# EAGLE design esc_board1 (EAGLE 9.2.2)
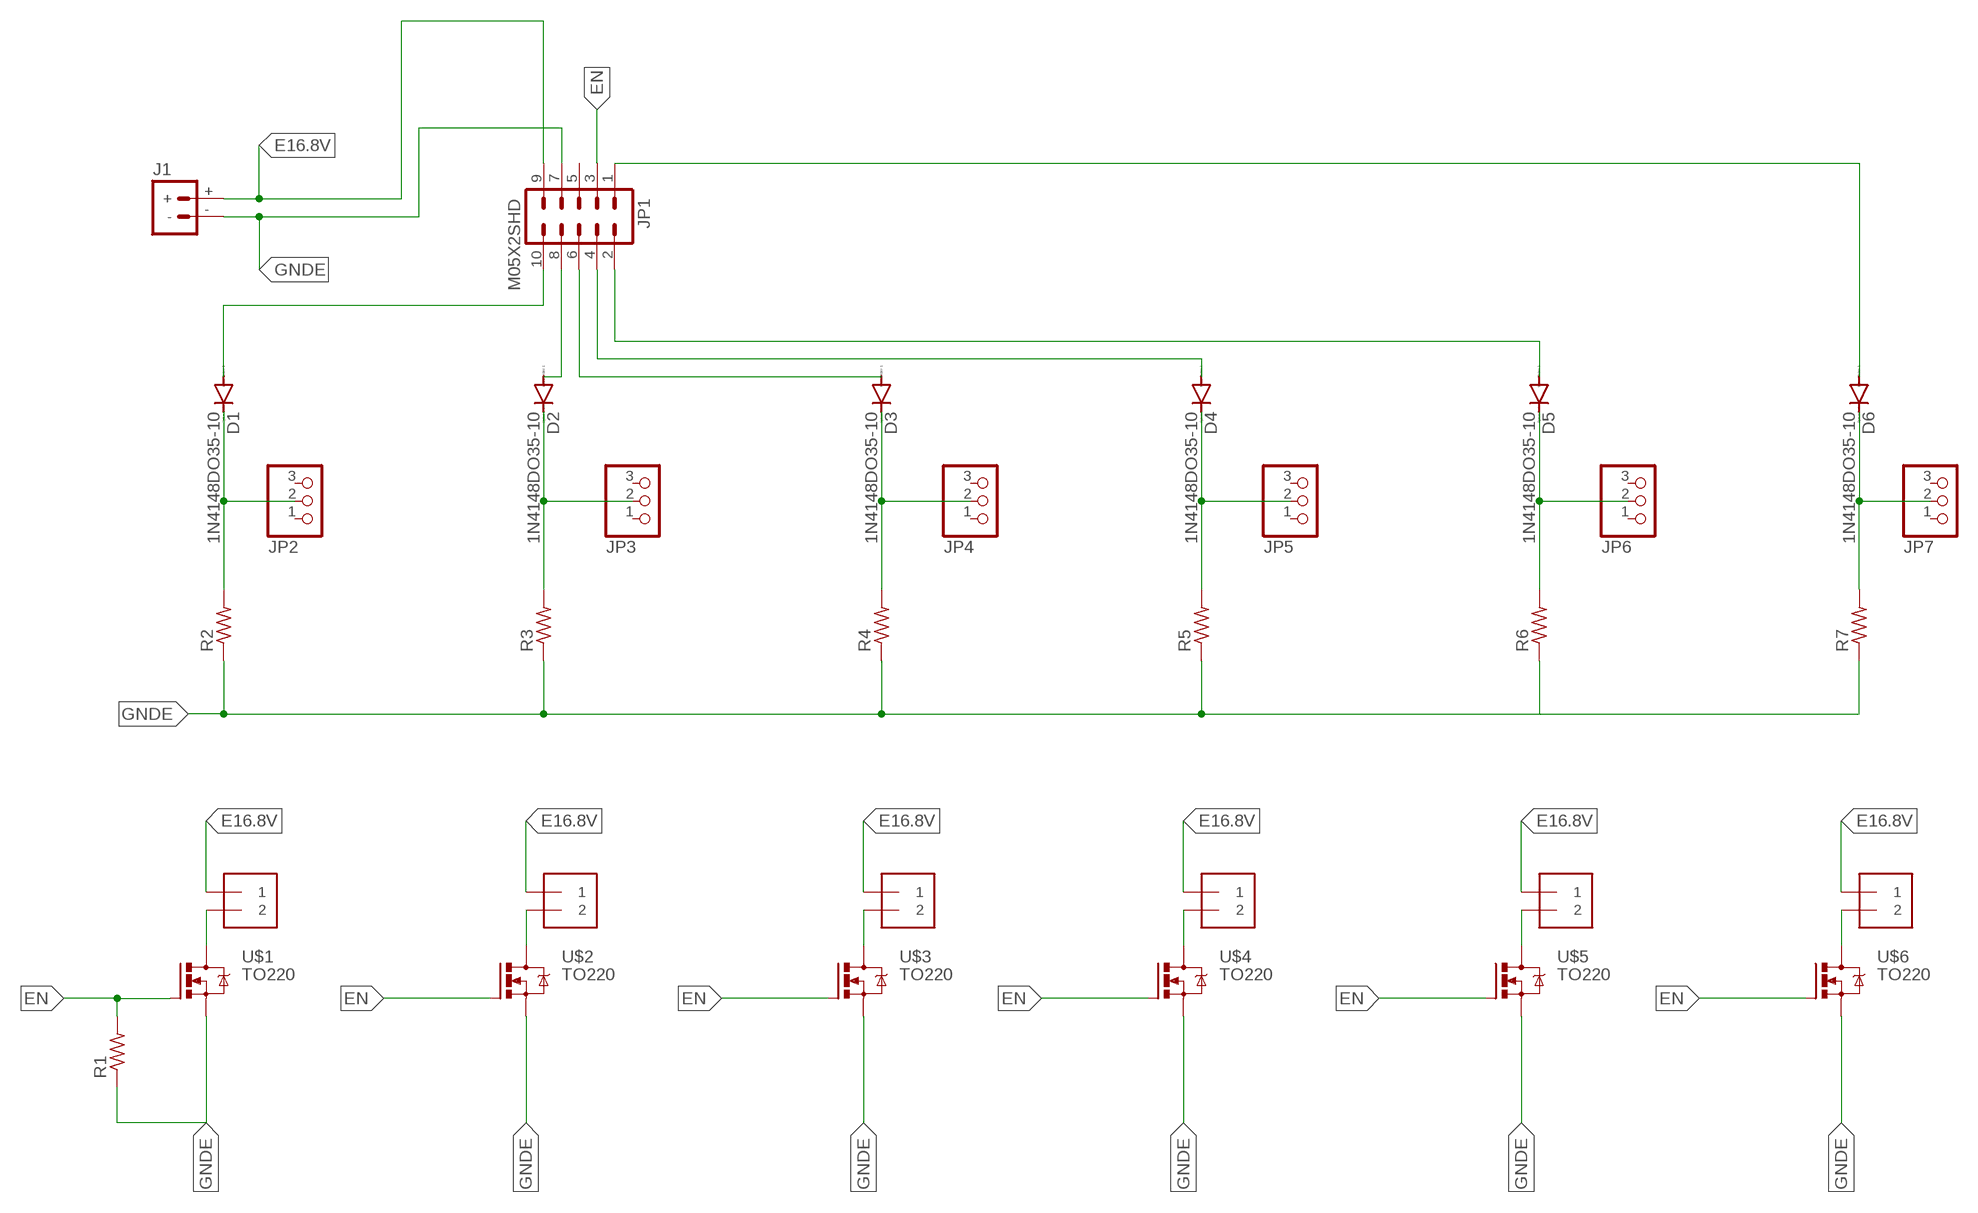
[diagram p0: schematic, sheet 1]

## Parts
D1  1N4148DO35-10  [DO35-10]
D2  1N4148DO35-10  [DO35-10]
D3  1N4148DO35-10  [DO35-10]
D4  1N4148DO35-10  [DO35-10]
D5  1N4148DO35-10  [DO35-10]
D6  1N4148DO35-10  [DO35-10]
J1  BATTERY_CONN_DEANS  [DEANS]
J7  1X2-3.5MM  [1X2-3.5MM]
J8  1X2-3.5MM  [1X2-3.5MM]
J9  1X2-3.5MM  [1X2-3.5MM]
J10  1X2-3.5MM  [1X2-3.5MM]
J11  1X2-3.5MM  [1X2-3.5MM]
J12  1X2-3.5MM  [1X2-3.5MM]
JP1  M05X2SHD  [2X5-SHROUDED]
JP2  PINHD-1X3  [1X03]
JP3  PINHD-1X3  [1X03]
JP4  PINHD-1X3  [1X03]
JP5  PINHD-1X3  [1X03]
JP6  PINHD-1X3  [1X03]
JP7  PINHD-1X3  [1X03]
R1  R-US_0204/7  [0204/7]
R2  R-US_0204/7  [0204/7]
R3  R-US_0204/7  [0204/7]
R4  R-US_0204/7  [0204/7]
R5  R-US_0204/7  [0204/7]
R6  R-US_0204/7  [0204/7]
R7  R-US_0204/7  [0204/7]
U$1  TO220  [IRF540]
U$2  TO220  [IRF540]
U$3  TO220  [IRF540]
U$4  TO220  [IRF540]
U$5  TO220  [IRF540]
U$6  TO220  [IRF540]

## Nets
E16.8V: J1.+ J7.1 J8.1 J9.1 J10.1 J11.1 J12.1 JP1.9
EN: JP1.3 R1.2 U$1.1(G) U$2.1(G) U$3.1(G) U$4.1(G) U$5.1(G) U$6.1(G)
GNDE: J1.- JP1.7 R1.1 R2.1 R3.1 R4.1 R5.1 R6.1 R7.1 U$1.3(S) U$2.3(S) U$3.3(S) U$4.3(S) U$5.3(S) U$6.3(S)
N$1: D1.A JP1.10
N$2: J7.2 U$1.2(D)
N$3: D1.C JP2.2 R2.2
N$4: D2.A JP1.8
N$5: J8.2 U$2.2(D)
N$6: D2.C JP3.2 R3.2
N$7: D3.A JP1.6
N$8: J9.2 U$3.2(D)
N$9: D3.C JP4.2 R4.2
N$10: D4.A JP1.4
N$11: J10.2 U$4.2(D)
N$12: D4.C JP5.2 R5.2
N$13: D5.A JP1.2
N$14: J11.2 U$5.2(D)
N$15: D5.C JP6.2 R6.2
N$16: D6.C JP7.2 R7.2
N$17: J12.2 U$6.2(D)
N$18: D6.A JP1.1
Unconnected: JP1.5 JP2.1 JP2.3 JP3.1 JP3.3 JP4.1 JP4.3 JP5.1 JP5.3 JP6.1 JP6.3 JP7.1 JP7.3

## Library data of the parts
D1-D6 = diode:1N4148: DIODE high speed (Philips)
J1 = SparkFun-Connectors:BATTERY_CONN: Battery Connectors Various footprints for battery connections SparkFun Products: Deans Connector -M/F Pair <https://www.sparkfun.com/products/11864>; SF_ID: PRT-11864
J7-J12 = adafruit:1X2: 3.5mm Terminal block http://www.ladyada.net/library/pcb/eaglelibrary.html
JP1 = SparkFun-Connectors:M05X2: Header 5x2 Standard 10-pin dual row 0.1" header. Commonly used with AVR-ISP. Use with Spark Fun Electronics SKU: PRT-00778
JP2-JP7 = adafruit:PINHD-1X3: PIN HEADER
R1-R7 = rcl:R-US_: RESISTOR, American symbol; SPICEPREFIX: R
U$1-U$6 = IRF540:TO220

## Board
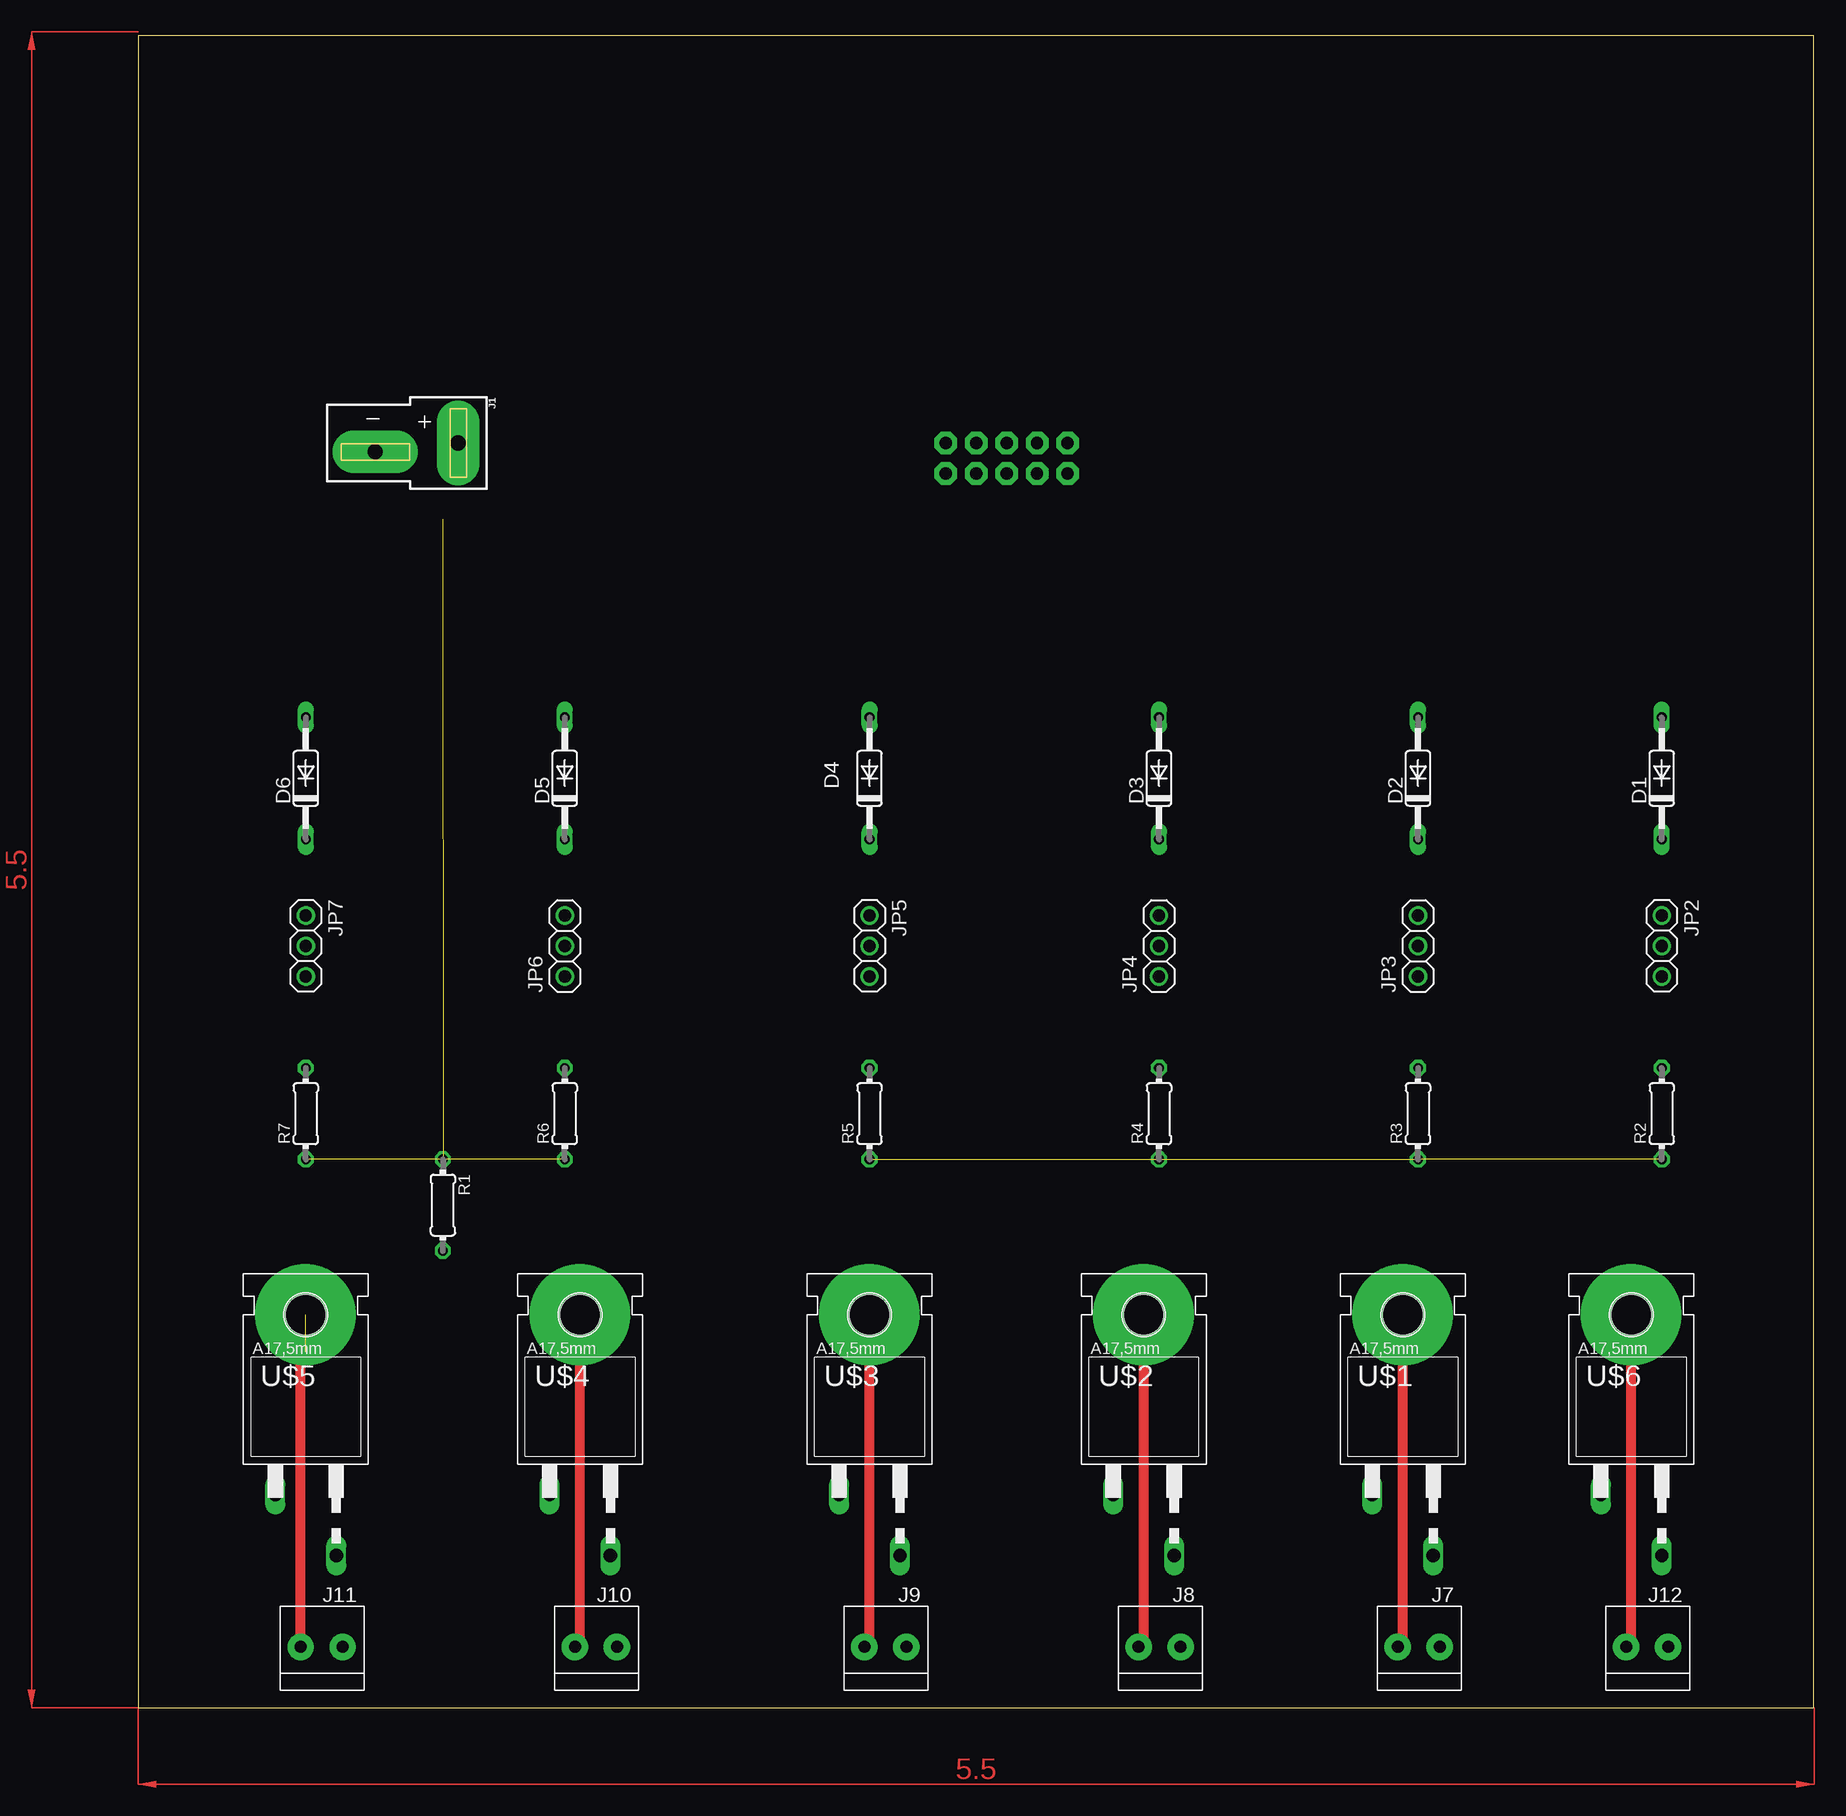
[diagram p1: board, top side]
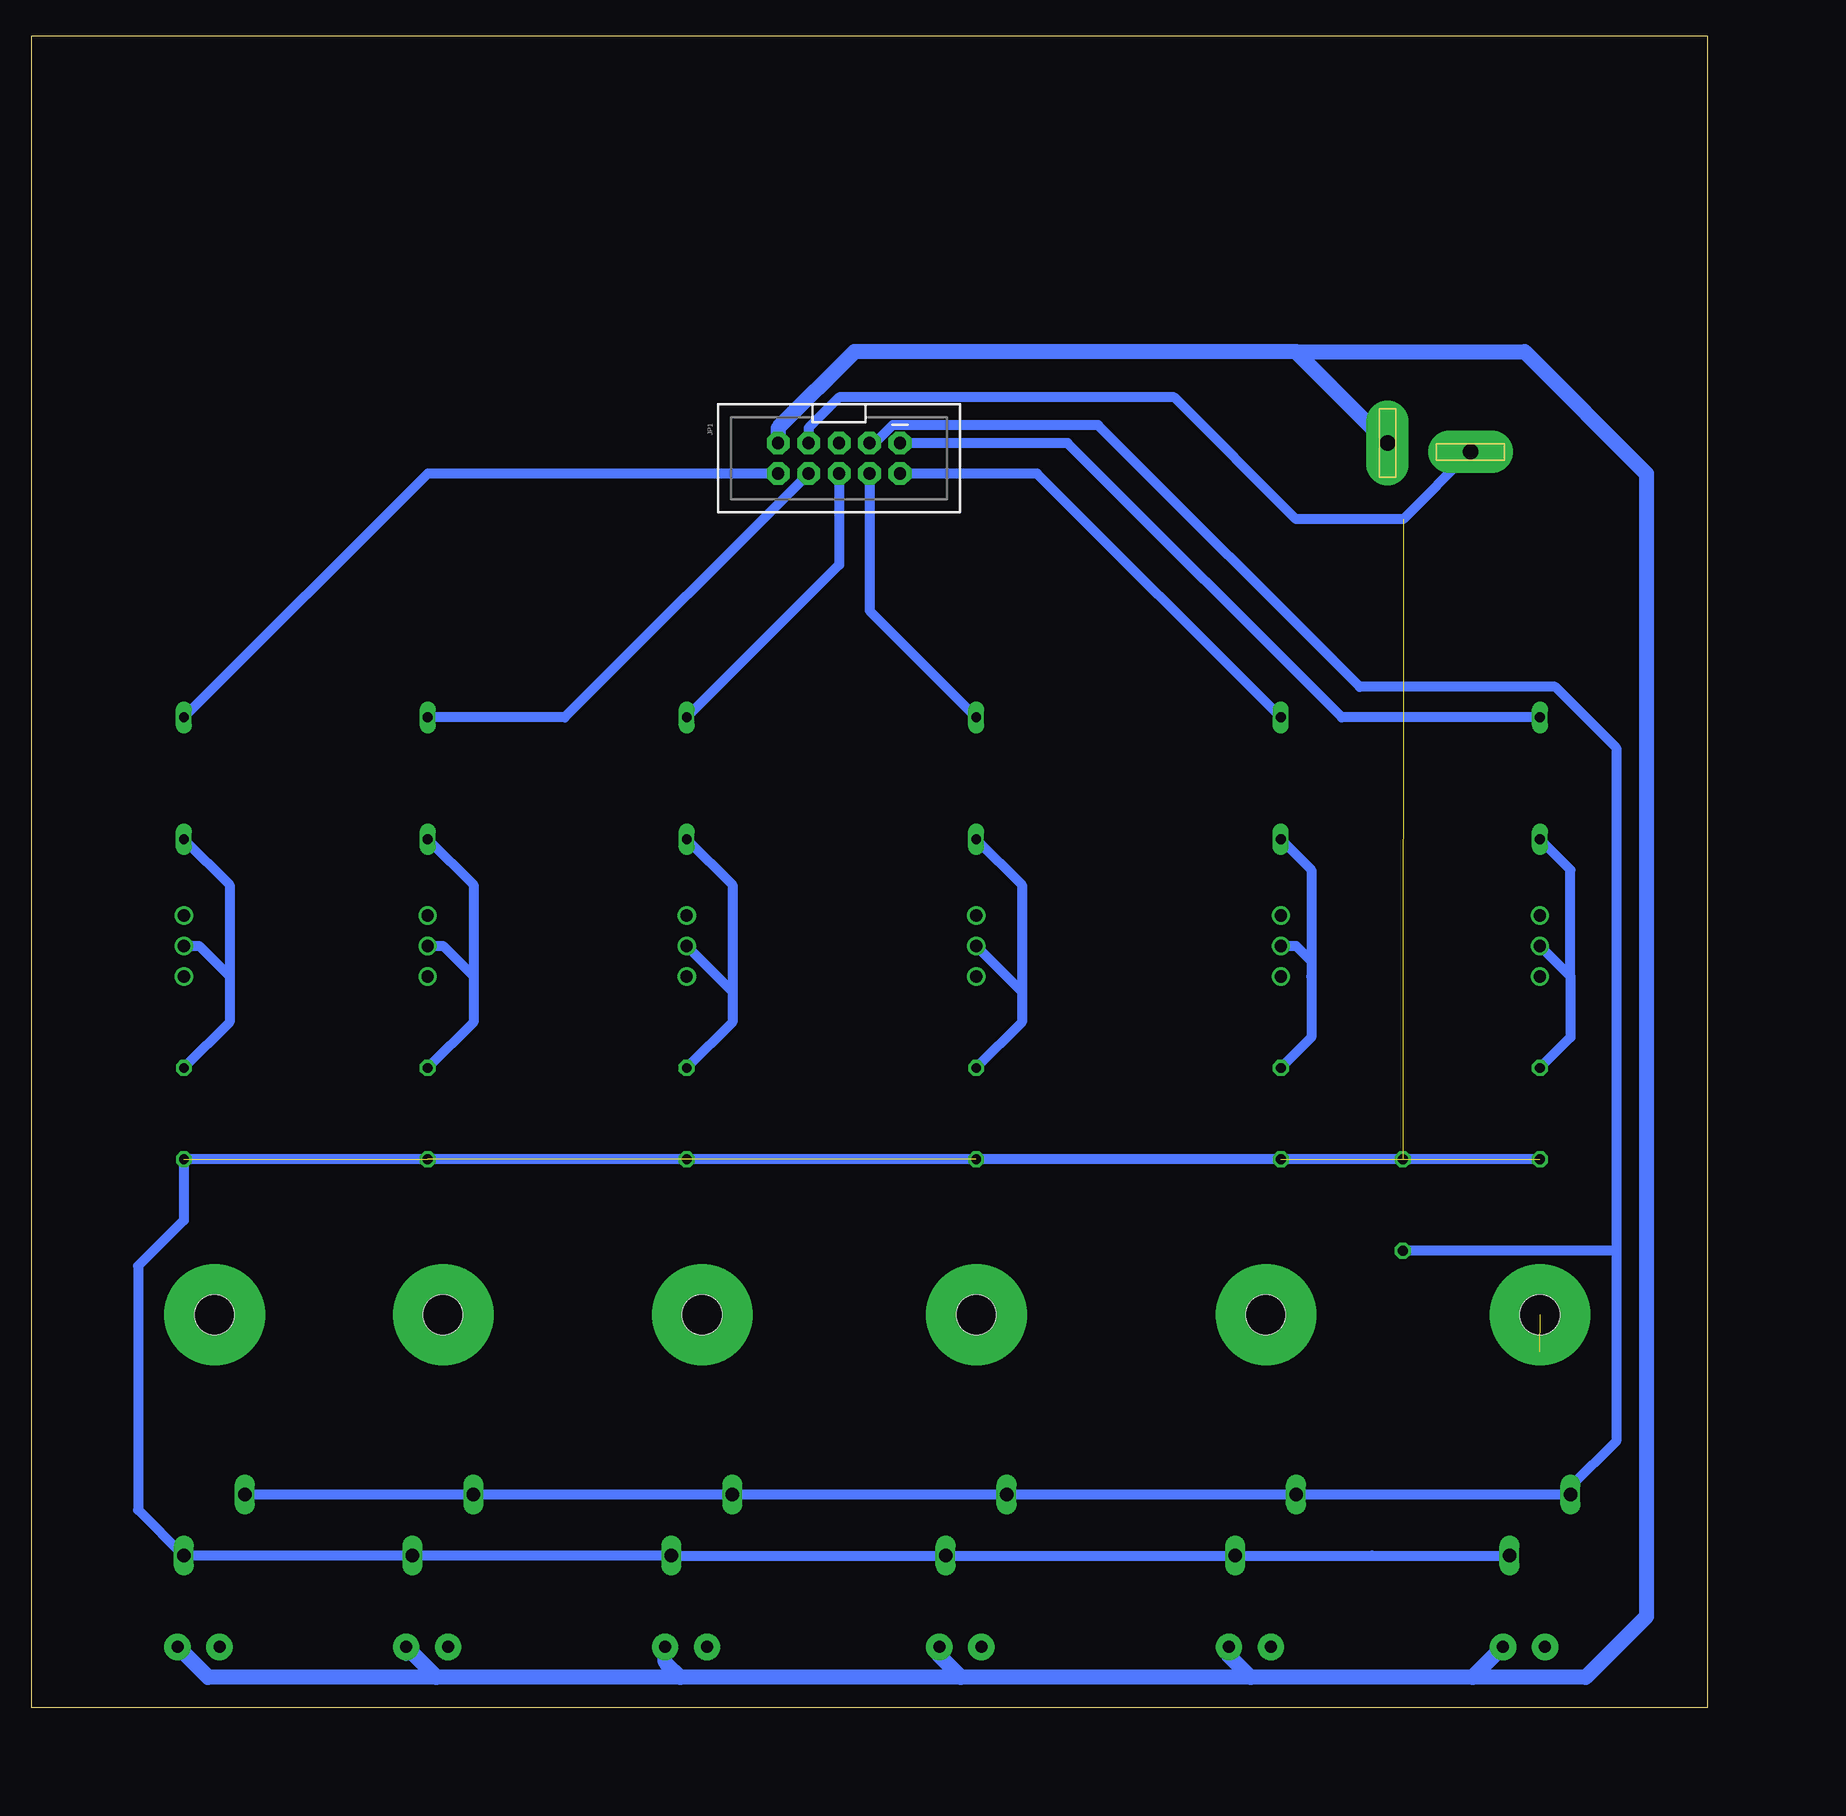
[diagram p2: board, bottom side, seen from below]

Size 139.68 x 139.37 mm. Coordinates in mm from the lower left corner, seen from the top.
Outline: 0,0 139.68,0 139.68,139.37 0,139.37 0,0
Copper layers (1*16): Top 0.035mm / dielectric 1.5mm / Bottom 0.035mm
Design rules "default": minimum track width 6mil, minimum drill 0.35mm, track to track 6mil, track to pad 6mil, pad to pad 6mil, via to via 6mil, smd to smd 6mil, copper to edge 40mil, drill to drill 6mil, minimum pad ring 10mil, minimum via ring 8mil, stop-mask expansion 4mil, vias tented up to drill 0mil, thermal gap 10mil

### Footprints (pad centres in the part's own frame; a part is rotated, then mirrored left to right if it is on the bottom)
DO35-10 = drill 0.813 long: A 5.08,0; C -5.08,0
DEANS = drill 1.27 pad 3.556 long: + 0,0; - 0.737,-6.921
1X2-3.5MM = drill 1 pad 2.184: 1 1.8,0; 2 -1.7,0
2X5-SHROUDED = drill 1.016 pad 1.88 octagon: 1 -1.27,5.08; 2 1.27,5.08; 3 -1.27,2.54; 4 1.27,2.54; 5 -1.27,0; 6 1.27,0; 7 -1.27,-2.54; 8 1.27,-2.54; 9 -1.27,-5.08; 10 1.27,-5.08
1X03 = drill 1.016: 1 -2.54,0; 2 0,0; 3 2.54,0
0204/7 = drill 0.813 octagon: 1 -3.81,0; 2 3.81,0
IRF540 = drill 1.118 long: 1 -2.54,-2.54; 3 2.54,-7.62 | drill 3.2 pad 8.382: 2 -0.025,12.446 | hole 3.302: 0,12.446

### Placement (x,y rotation side)
D1  127,77.47 90 top
D2  106.68,77.47 90 top
D3  85.09,77.47 90 top
D4  60.96,77.47 90 top
D5  35.56,77.47 90 top
D6  13.97,77.47 90 top
J1  26.67,105.41 270 top
J7  106.68,5.08 0 top
J8  85.09,5.08 0 top
J9  62.23,5.08 0 top
J10  38.1,5.08 0 top
J11  15.24,5.08 0 top
J12  125.73,5.08 0 top
JP1  72.39,104.14 270 bottom
JP2  127,63.5 270 top
JP3  106.68,63.5 90 top
JP4  85.09,63.5 90 top
JP5  60.96,63.5 270 top
JP6  35.56,63.5 90 top
JP7  13.97,63.5 270 top
R1  25.4,41.91 270 top
R2  127,49.53 90 top
R3  106.68,49.53 90 top
R4  85.09,49.53 90 top
R5  60.96,49.53 90 top
R6  35.56,49.53 90 top
R7  13.97,49.53 90 top
U$1  105.41,20.32 0 top
U$2  83.82,20.32 0 top
U$3  60.96,20.32 0 top
U$4  36.83,20.32 0 top
U$5  13.97,20.32 0 top
U$6  124.46,20.32 0 top

### Tracks (layer width: path | path; a pad name or v marks a point on that pad's centre or on a via)
E16.8V
  Bottom 0.813: J7.1 108.48,4.34 | J8.1 86.89,4.34 | 64.03,4.34 J9.1 | 39.9,4.34 J10.1
  Bottom 1.27: J11.1 19.58,2.54 | 19.58,2.54 38.1,2.54 | 38.1,2.54 39.9,4.34 | 38.1,2.54 62.23,2.54 | 62.23,2.54 64.03,4.34 | 62.23,2.54 85.62,2.54 | J8.1 86.89,3.81 85.62,2.54 | 85.62,2.54 105.94,2.54 | 105.94,2.54 J7.1 | 105.94,2.54 124.99,2.54 J12.1 | J1.+ 34.29,113.03 | 34.29,113.03 71.12,113.03 77.47,106.68 JP1.9 | 34.29,113.03 15.24,113.03 5.08,102.87 5.08,7.62 10.16,2.54 19.58,2.54
EN
  Bottom 0.813: U$2.1 U$4.1 U$5.1 11.43,18.41 7.62,22.23 7.62,38.1 | U$2.1 U$6.1 U$1.1 | U$3.1 U$2.1 | 7.62,38.1 R1.2 | JP1.3 69.43,105.41 67.93,106.91 50.8,106.91 28.98,85.09 12.7,85.09 7.62,80.01 7.62,38.1
GNDE  (6 unrouted)
  Bottom 0.813: U$5.3 27.94,12.7 U$4.3 U$3.3 U$2.3 U$1.3 U$6.3 130.81,16.51 130.81,36.83 127,40.64 R2.1 R7.1 | J1.- 25.36,99.06 34.29,99.06 44.45,109.22 72.39,109.22 74.93,106.68 JP1.7
N$1
  Bottom 0.813: JP1.10 106.68,102.87 D1.A
N$2
  Top 0.813: U$1.2 105.39,5.49 J7.2
N$3
  Bottom 0.813: D1.C 123.19,68.58 123.19,60.96 | 123.19,60.96 123.19,57.15 R2.2 | JP2.2 125.73,63.5 123.19,60.96
N$4
  Bottom 0.813: JP1.8 95.25,82.55 D2.A
N$5
  Top 0.813: U$2.2 83.8,5.11 | 83.8,5.11 83.82,5.08 | J8.2 83.77,5.08 83.8,5.11
N$6
  Bottom 0.813: D2.C 102.87,68.58 102.87,60.96 | 102.87,60.96 102.87,57.15 R3.2 | JP3.2 105.41,63.5 102.87,60.96
N$7
  Bottom 0.813: JP1.6 72.39,95.25 D3.A
N$8
  Top 0.813: U$3.2 60.94,5.11 | 60.94,5.11 60.96,5.08 | J9.2 60.91,5.08 60.94,5.11
N$9
  Bottom 0.813: D3.C 81.28,68.58 81.28,59.69 | 81.28,59.69 81.28,57.15 R4.2 | JP4.2 81.28,59.69
N$10
  Bottom 0.813: JP1.4 69.85,91.44 D4.A
N$11
  Top 0.813: U$4.2 36.8,5.11 | 36.8,5.11 36.83,5.08 | J10.2 36.78,5.08 36.8,5.11
N$12
  Bottom 0.813: D4.C 57.15,68.58 57.15,59.69 | 57.15,59.69 57.15,57.15 R5.2 | JP5.2 57.15,59.69
N$13
  Bottom 0.813: D5.A 55.88,102.87 JP1.2
N$14  (1 unrouted)
  Top 0.813: J11.2 13.54,29.26 13.97,29.69
N$15
  Bottom 0.813: D5.C 33.02,69.85 33.02,62.23 | R6.2 33.02,55.88 33.02,60.96 33.02,62.23 | JP6.2 34.29,63.5 33.02,62.23
N$16
  Bottom 0.813: JP7.2 11.43,60.96 | 11.43,60.96 11.43,55.88 R7.2 | 11.43,60.96 11.43,69.85 D6.C
N$17
  Top 0.813: U$6.2 124.44,5.49 J12.2
N$18
  Bottom 0.813: D6.A 30.48,82.55 53.34,105.41 JP1.1
(copper drawn outside any net)
  shapes: Top area x2